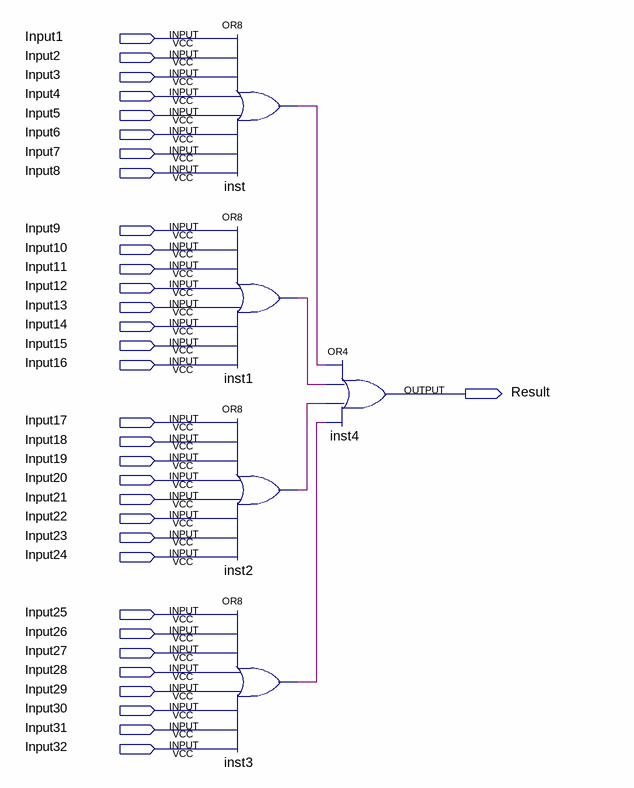
[diagram p0: schematic sheet]
// Quartus schematic or_32bit.bdf as structural Verilog: 5 symbols, 33 pins
module or_32bit (
  input  Input1,
  input  Input2,
  input  Input3,
  input  Input4,
  input  Input5,
  input  Input6,
  input  Input7,
  input  Input8,
  input  Input9,
  input  Input10,
  input  Input11,
  input  Input12,
  input  Input13,
  input  Input14,
  input  Input15,
  input  Input16,
  input  Input17,
  input  Input18,
  input  Input19,
  input  Input20,
  input  Input21,
  input  Input22,
  input  Input23,
  input  Input24,
  input  Input25,
  input  Input26,
  input  Input27,
  input  Input28,
  input  Input29,
  input  Input30,
  input  Input31,
  input  Input32,
  output Result
);

  wire inst1_out, inst2_out, inst3_out, inst_out;

  or inst (inst_out, Input1, Input2, Input3, Input4, Input5, Input6, Input7, Input8);
  or inst1 (inst1_out, Input9, Input10, Input11, Input12, Input13, Input14, Input15, Input16);
  or inst2 (inst2_out, Input17, Input18, Input19, Input20, Input21, Input22, Input23, Input24);
  or inst3 (inst3_out, Input25, Input26, Input27, Input28, Input29, Input30, Input31, Input32);
  or inst4 (Result, inst_out, inst1_out, inst2_out, inst3_out);
endmodule
